# Altium schematic sheet PowerToSer.SchDoc
size A4; SheetNumber: 3; SheetTotal: 6
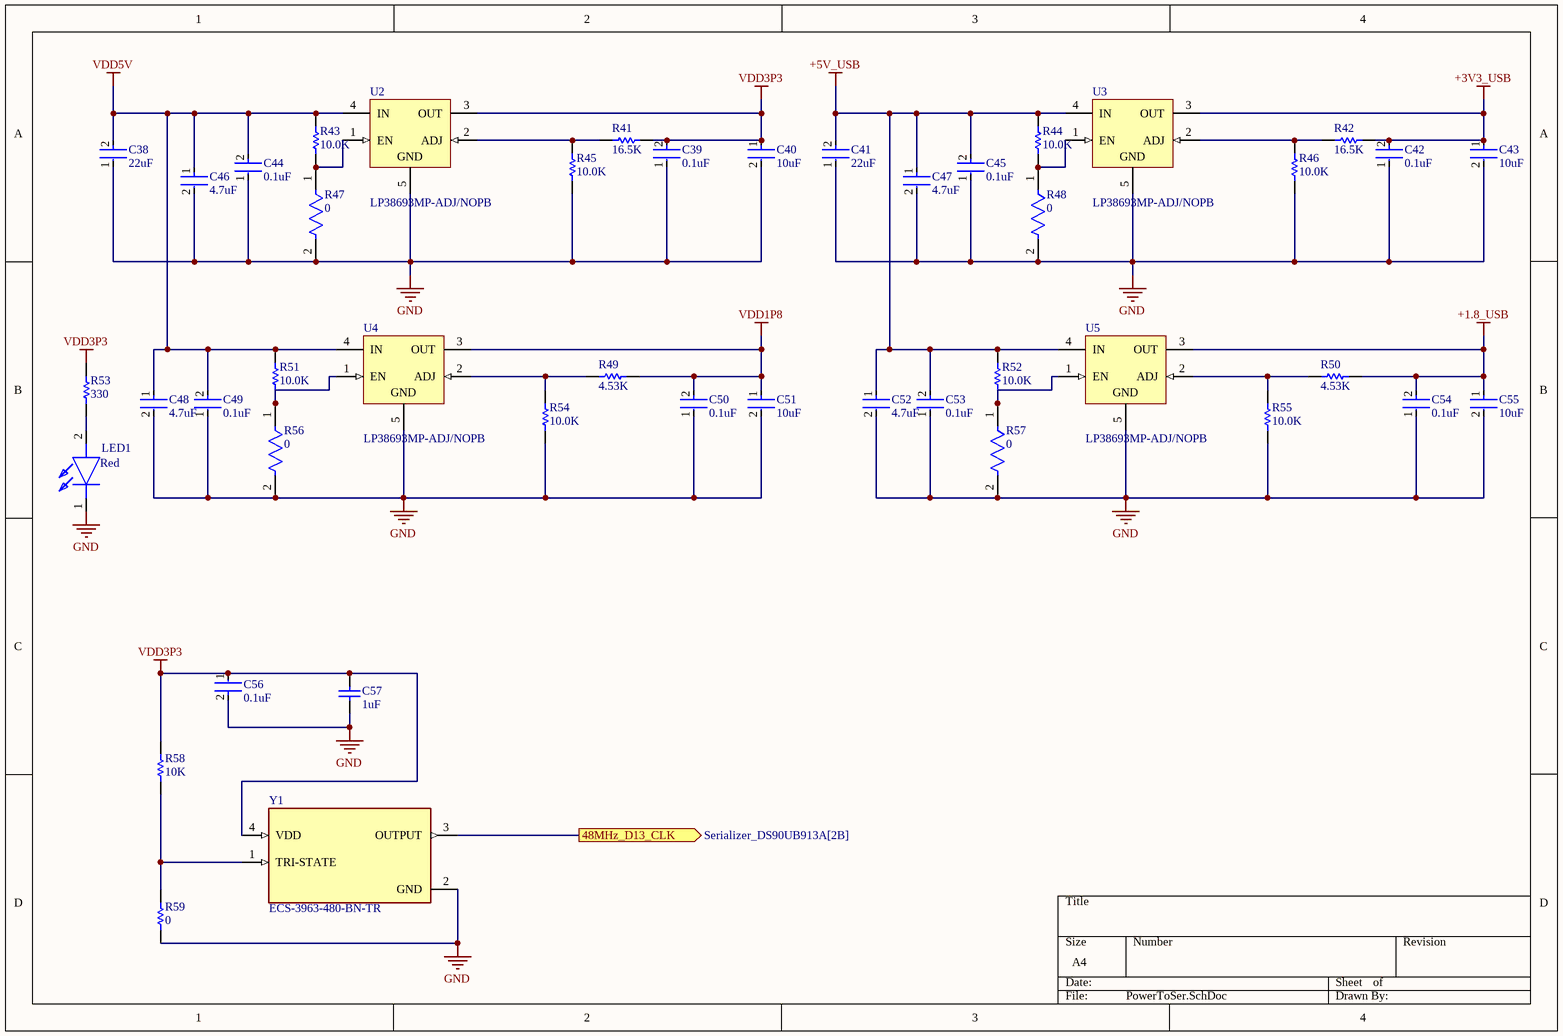
[diagram p0: PowerToSer.SchDoc]

## Parts
C38  22uF  [FP-GCM32E-0_3-IPC_B]
C39  0.1uF  [FP-GRM15-MFG]
C40  10uF  [FP-GRM21B-0_1-IPC_C]
C41  22uF  [FP-GCM32E-0_3-IPC_B]
C42  0.1uF  [FP-GRM15-MFG]
C43  10uF  [FP-GRM21B-0_1-IPC_C]
C44  0.1uF  [FP-GRM15-MFG]
C45  0.1uF  [FP-GRM15-MFG]
C46  4.7uF  [FP-GRM21B-0_15-MFG]
C47  4.7uF  [FP-GRM21B-0_15-MFG]
C48  4.7uF  [FP-GRM21B-0_15-MFG]
C49  0.1uF  [FP-GRM15-MFG]
C50  0.1uF  [FP-GRM15-MFG]
C51  10uF  [FP-GRM21B-0_1-IPC_C]
C52  4.7uF  [FP-GRM21B-0_15-MFG]
C53  0.1uF  [FP-GRM15-MFG]
C54  0.1uF  [FP-GRM15-MFG]
C55  10uF  [FP-GRM21B-0_1-IPC_C]
C56  0.1uF  [FP-GRM15-MFG]
C57  1uF  [CAPC1608X90X35ML10T15]
LED1  Red  [LEDC1608X55N]
R41  16.5K  [RESC1608X55X30LL15T15]
R42  16.5K  [RESC1608X55X30LL15T15]
R43  10.0K  [RESC1609X55X30LL15T15]
R44  10.0K  [RESC1609X55X30LL15T15]
R45  10.0K  [RESC1609X55X30LL15T15]
R46  10.0K  [RESC1609X55X30LL15T15]
R47  0  [FP-ERJ-3GEY0R00V-MFG]
R48  0  [FP-ERJ-3GEY0R00V-MFG]
R49  4.53K  [RESC1608X55X30ML15T15]
R50  4.53K  [RESC1608X55X30ML15T15]
R51  10.0K  [RESC1609X55X30LL15T15]
R52  10.0K  [RESC1609X55X30LL15T15]
R53  330  [RESC1005X40X25ML05T05]
R54  10.0K  [RESC1609X55X30LL15T15]
R55  10.0K  [RESC1609X55X30LL15T15]
R56  0  [FP-ERJ-3GEY0R00V-MFG]
R57  0  [FP-ERJ-3GEY0R00V-MFG]
R58  10K  [RESC1005X40X25ML05T05]
R59  0  [RESC1005X40X25LL05T05]
U2  LP38693MP-ADJ/NOPB  [NDC0005A_N]
U3  LP38693MP-ADJ/NOPB  [NDC0005A_N]
U4  LP38693MP-ADJ/NOPB  [NDC0005A_N]
U5  LP38693MP-ADJ/NOPB  [NDC0005A_N]
Y1  ECS-3963-480-BN-TR  [OSC_ECS-3963-480-BN-TR]

## Ports
48MHz_D13_CLK (out, see Serializer_DS90UB913A[2B])

## Nets
+1.8_USB: C54.2 C55.1 R50.2 U5.3(OUT)
+3V3_USB: C42.2 C43.1 R42.2 U3.3(OUT)
+5V_USB: C41.2 C45.2 C47.1 C52.1 C53.2 R44.1 R52.1 U3.4(IN) U5.4(IN)
GND: C38.1 C39.1 C40.2 C41.1 C42.1 C43.2 C44.1 C45.1 C46.2 C47.2 C48.2 C49.1 C50.1 C51.2 C52.2 C53.1 C54.1 C55.2 C56.2 C57.2 LED1.1(K) R45.2 R46.2 R47.2 R48.2 R54.2 R55.2 R56.2 R57.2 R59.2 U2.5(GND) U3.5(GND) U4.5(GND) U5.5(GND) Y1.2(GND)
VDD1P8: C50.2 C51.1 R49.2 U4.3(OUT)
VDD3P3: C39.2 C40.1 C56.1 C57.1 R41.2 R53.1 R58.1 U2.3(OUT) Y1.4(VDD)
VDD5V: C38.2 C44.2 C46.1 C48.1 C49.2 R43.1 R51.1 U2.4(IN) U4.4(IN)
48MHz_D13_CLK: Y1.3(OUTPUT) ; port 48MHz_D13_CLK
NetLED1_2: LED1.2(A) R53.2
NetR41_1: R41.1 R45.1 U2.2(ADJ)
NetR42_1: R42.1 R46.1 U3.2(ADJ)
NetR43_2: R43.2 R47.1 U2.1(EN)
NetR44_2: R44.2 R48.1 U3.1(EN)
NetR49_1: R49.1 R54.1 U4.2(ADJ)
NetR50_1: R50.1 R55.1 U5.2(ADJ)
NetR51_2: R51.2 R56.1 U4.1(EN)
NetR52_2: R52.2 R57.1 U5.1(EN)
NetR58_2: R58.2 R59.1 Y1.1(TRI-STATE)

## Library data of the parts
C38 C41 = CMP-06035-049658-1: Ceramic Capacitor for Automotive 22uF ±10% 16VDC X7R 1210 Embossed T/R; Voltage Rating: 16V; Max Operating Temperature: 125°C; Case/Package: 1210; Packaging: Tape and Reel; Termination: SMD/SMT; Height: 2.5mm; Voltage Rating (DC): 16V; Length: 3.2mm; Width: 0.098inch; Voltage: 16V; Depth: 2.5mm; Package Quantity: 1; Mount: Surface Mount; Min Operating Temperature: -55°C; Case Code (Metric): 3225; Case Code (Imperial): 1210; Radiation Hardening: No; Thickness: 0.106inch; Ratings: AEC-Q200; Capacitance: 22uF; Tolerance: 10%; Dielectric: X7R; Lead Free: Lead Free
C39 C42 C44 C45 C49 C50 C53 C54 C56 = CMP-2100-03641-2: CAP CER 0.1UF 16V X7R 0402; Manufacturer Part Number: GRM155R71C104KA88D; Manufacturer: Murata; Standoff Height: 0mm; Tolerance: 10%; Voltage Rating: 16Vdc; Material: Ceramic; Capacitance: 0.10μF; Value: 0.10μF; RoHS: TRUE; Temperature Characteristic: X7R; Octopart: https://octopart.com/grm155r71c104ka88d-murata-196880; Digikey Description: CAP CER 0.1UF 16V X7R 0402; Device Class L3: Ceramic Capacitors; Height: 0.55mm; ComponentLink2Description: Datasheet; Temperature Range Low: -55°C; Ipc Land Pattern Name: CAPC10050X219; ComponentLink2URL: https://search.murata.co.jp/Ceramy/image/img/A01X/G101/ENG/GRM155R71H471KA01-01A.pdf; Device Class L1: Passive Components; Lead Free: yes; Category: Cap; Package: GRM15; Temperature: -55°C to +125°C; Device Class L2: Capacitors; Temperature Range High: +125°C; Mouser Description: 0402 0.1 uF 16V ±10 % Tolerance X7R SMT Multilayer Ceramic Capacitor
C40 C43 C51 C55 = CMP-2007-03453-2: Chip Multilayer Ceramic Capacitors for General Purpose, 0805, 10uF, X5R, 15%, 10%, 16V; Radiation Hardening: No; Thickness: 0.053inch; Voltage Rating (DC): 16V; Lead Free: Lead Free; Package Quantity: 1; Width: 1.25mm; Case Code (Imperial): 0805; Depth: 1.25mm; Packaging: Tape and Reel; Dielectric: X5R; Max Operating Temperature: 85°C; Tolerance: 10%; Voltage Rating: 16V; Voltage: 16V; Capacitance: 10uF; Height: 1.25mm; Case Code (Metric): 2012; Material: Ceramic; Mount: Surface Mount; Case/Package: 0805; REACH SVHC: No SVHC; Length: 2mm; Min Operating Temperature: -55°C; Termination: SMD/SMT
C46-C48 C52 = CMP-2007-03401-2: CAP CER 4.7UF 16V X7R 0805; Material: Ceramic; Tolerance: 10%; Case Code (Metric): 2012; Voltage Rating: 16V; RoHS Compliant: Yes; Voltage Rating (DC): 16V; Case/Package: 0805; Number of Pins: 2; Thickness: 0.053inch; Voltage: 16V; Mount: Surface Mount; Packaging: Tape and Reel; Lead Free: Lead Free; Case Code (Imperial): 0805; Series: GRM; Width: 0.049inch; Package Quantity: 1; Construction: Flat; Min Operating Temperature: -55°C; Termination: SMD/SMT; Max Operating Temperature: 125°C; Length: 2mm; Dielectric: X7R; Depth: 1.25mm; REACH SVHC: No SVHC; Height: 1.25mm; Capacitance: 4.7uF
C57 = CMP-2006-02460-1: Manufacturer: Murata; Part Number: GRM188R71E105KA12D
LED1 = LTST-C191KRKT: LED; Manufacturer_Name: Lite-On; Datasheet Link: http://www.mouser.com/ds/2/239/S_110_LTST-C191KRKT-539838.pdf; Height: 0.55mm; Manufacturer_Part_Number: LTST-C191KRKT; Mouser Part Number: 859-LTST-C191KRKT; Mouser Price/Stock: https://www.mouser.co.uk/ProductDetail/LITEON/LTST-C191KRKT?qs=BAIUz4Y8PJBLfOhzue0q%252BA%3D%3D; Arrow Part Number: LTST-C191KRKT; Arrow Price/Stock: https://www.arrow.com/en/products/ltst-c191krkt/lite-on-technology?utm_currency=USD&region=nac
R41 R42 = CMP-2000-00279-1: Manufacturer: Panasonic; Part Number: ERJ-3EKF1652V
R43-R46 R51 R52 R54 R55 = CMP-1012-00623-3: Chip Resistor, 10 KOhm, +/- 1%, 0.1 W, -55 to 155 degC, 0603 (1608 Metric), RoHS, Tape and Reel; Manufacturer: Panasonic; Voltage Rating: 75V; Case\/Package: 0603; Power Rating: 100mW; Resistance: 10KOhm; Temperature Coefficient: 100ppm\/degreesC; Number of Pins: 2; Package Reference: 603; Depth: 0.8mm; Mount: SurfaceMount; Package Description: 2-Pin Surface Mount Device, Body 1.6 x 0.85 mm; Datasheet Version: 02/2017; Length: 1.6mm; Lead Free: LeadFree; Height: 0.45mm; Number of Terminations: 2; Max Power Dissipation: 100mW; Min Operating Temperature: -55degC; Datasheet URL: https://industrial.panasonic.com/cdbs/www-data/pdf/RDA0000/AOA0000C304.pdf; Termination: SMD/SMT; Case Code (Metric): 1608; Case Code (Imperial): 0603; Tolerance: 1%; Max Operating Temperature: 155degC; RoHSCompliant: true; Voltage Rating (DC): 75V; Radiation Hardening: No; Packaging: TapeandReel; Composition: ThickFilm; Mounting Technology: SurfaceMount; Manufacturer URL: http://www.panasonic.com/; Width: 0.031inch; REACH SVHC: NoSVHC; Contact Plating: Tin; Military Standard: Not; Package Quantity: 1
R47 R48 R56 R57 = CMP-2000-00700-2: RES SMD 0 OHM JUMPER 1/10W 0603; Manufacturer Part Number: ERJ-3GEY0R00V; Manufacturer: Panasonic; Tolerance: 5%; Automotive Grade: Grade 0; Voltage Rating: 75V; Value: 0Ω; Temperature Coefficient: -100/+600ppm/°C; Power Rating: 0.1W; Mouser Description: Resistor, Chip Thick Film, 0 Ohm, 0.1w, Resistor, Chip Thick Film, 0 Ohm, 0.1w, 5%; Ipc Land Pattern Name: RESC16080X45; Category: Res; Package: 0603; Temperature: -55°C to +155°C; Temperature Range Low: -55°C; Series: ERJ; Resistance: 0Ω; RoHS: TRUE; Composition: Thick Film; Octopart: https://octopart.com/erj-3gey0r00v-panasonic-55389238; Device Class L1: Passive Components; Footprint Url: https://industrial.panasonic.com/cdbs/www-data/pdf/RDA0000/DMA0000COL17.pdf; ComponentLink2Description: Datasheet; Device Class L2: Resistors; Temperature Range High: +155°C; Digikey Description: RES SMD 0 OHM JUMPER 1/10W 0603; Lead Free: Yes; Device Class L3: Chip SMD Resistors; Height: 0.55mm; ComponentLink2URL: https://industrial.panasonic.com/cdbs/www-data/pdf/RDA0000/AOA0000C301.pdf; Automotive: Yes
R49 R50 = CMP-2000-00512-1: Part Number: ERJ-3EKF4531V; Manufacturer: Panasonic
R53 = CMP-2002-01143-1: Manufacturer: Panasonic; Part Number: ERJ2RKF3300X
R58 = CMP-2002-00433-1: Part Number: ERJ-2GEJ103X; Manufacturer: Panasonic
R59 = CMP-2000-07451-1: Chip Resistor, 0 Ohm, 0.1 W, -55 to 155 degC, 0402 (1005 Metric), RoHS, Tape and Reel; Manufacturer: Panasonic; Voltage Rating (DC): 50V; Temperature Coefficient: 600ppm/��C; Max Power Dissipation: 100mW; Resistance: 0mOhm; Tolerance: 5%; Number of Terminations: 2; Mount: SurfaceMount; Height: 0.35mm; Packaging: TapeandReel; Contact Plating: Tin; Manufacturer URL: http://www.panasonic.com/; Composition: ThickFilm; Max Operating Temperature: 155degC; REACH SVHC: NoSVHC; Case/Package: 0402; Package Reference: 402; Depth: 0.5mm; Package Description: 2-Pin Surface Mount Device, Body 1 x 0.5 mm; Datasheet URL: https://industrial.panasonic.com/cdbs/www-data/pdf/RDA0000/AOA0000C301.pdf; RoHSCompliant: True; Case Code (Imperial): 0402; Military Standard: Not; Min Operating Temperature: -55degC; Power Rating: 100mW; Datasheet Version: 03/2015; Length: 1mm; Case Code (Metric): 1005; Termination: SMD/SMT; Mounting Technology: SurfaceMount; Voltage Rating: 50V; Width: 0.02inch; Package Quantity: 1; Lead Free: LeadFree; Radiation Hardening: No
U2-U5 = CMP-0062-01809-4: 500mA Low Dropout CMOS Linear Regulators with Adjustable Output Stable with Ceramic Output Capacitors, 5-pin SOT-223, Pb-Free, 1000 Reel; Manufacturer: Texas Instruments; PackageTopMarking: XYTT*LJUB; CompType: LDO IC; PowerWise: Y; PackageReference: NDC0005A; ComponentLink1Description: Datasheet URL; RoHS: Y; PackageDescription: Moldec SOT-223, 6.50 x 3.56 x 1.6mm Body, 5 Lead, 1.5mm Pitch; ComponentLink1URL: http://www.ti.com/general/docs/lit/getliterature.tsp?genericPartNumber=LP38693-ADJ&fileType=pdf; PartNumber: LP38693MP-ADJ/NOPB; High-Reliability: Y; Code_JEDEC: TO-261-AB; Code_IPC: SOT223-5; PinCount: 5
Y1 = ECS-3963-480-BN-TR: miniature SMD crystal controlled oscillators; Package: None; Price: None; Value: *; MP: ECS-3963-480-BN-TR; Availability: Unavailable